# Altium schematic sheet Sheet2.SchDoc
size A4; SheetNumber: 2; SheetTotal: 2
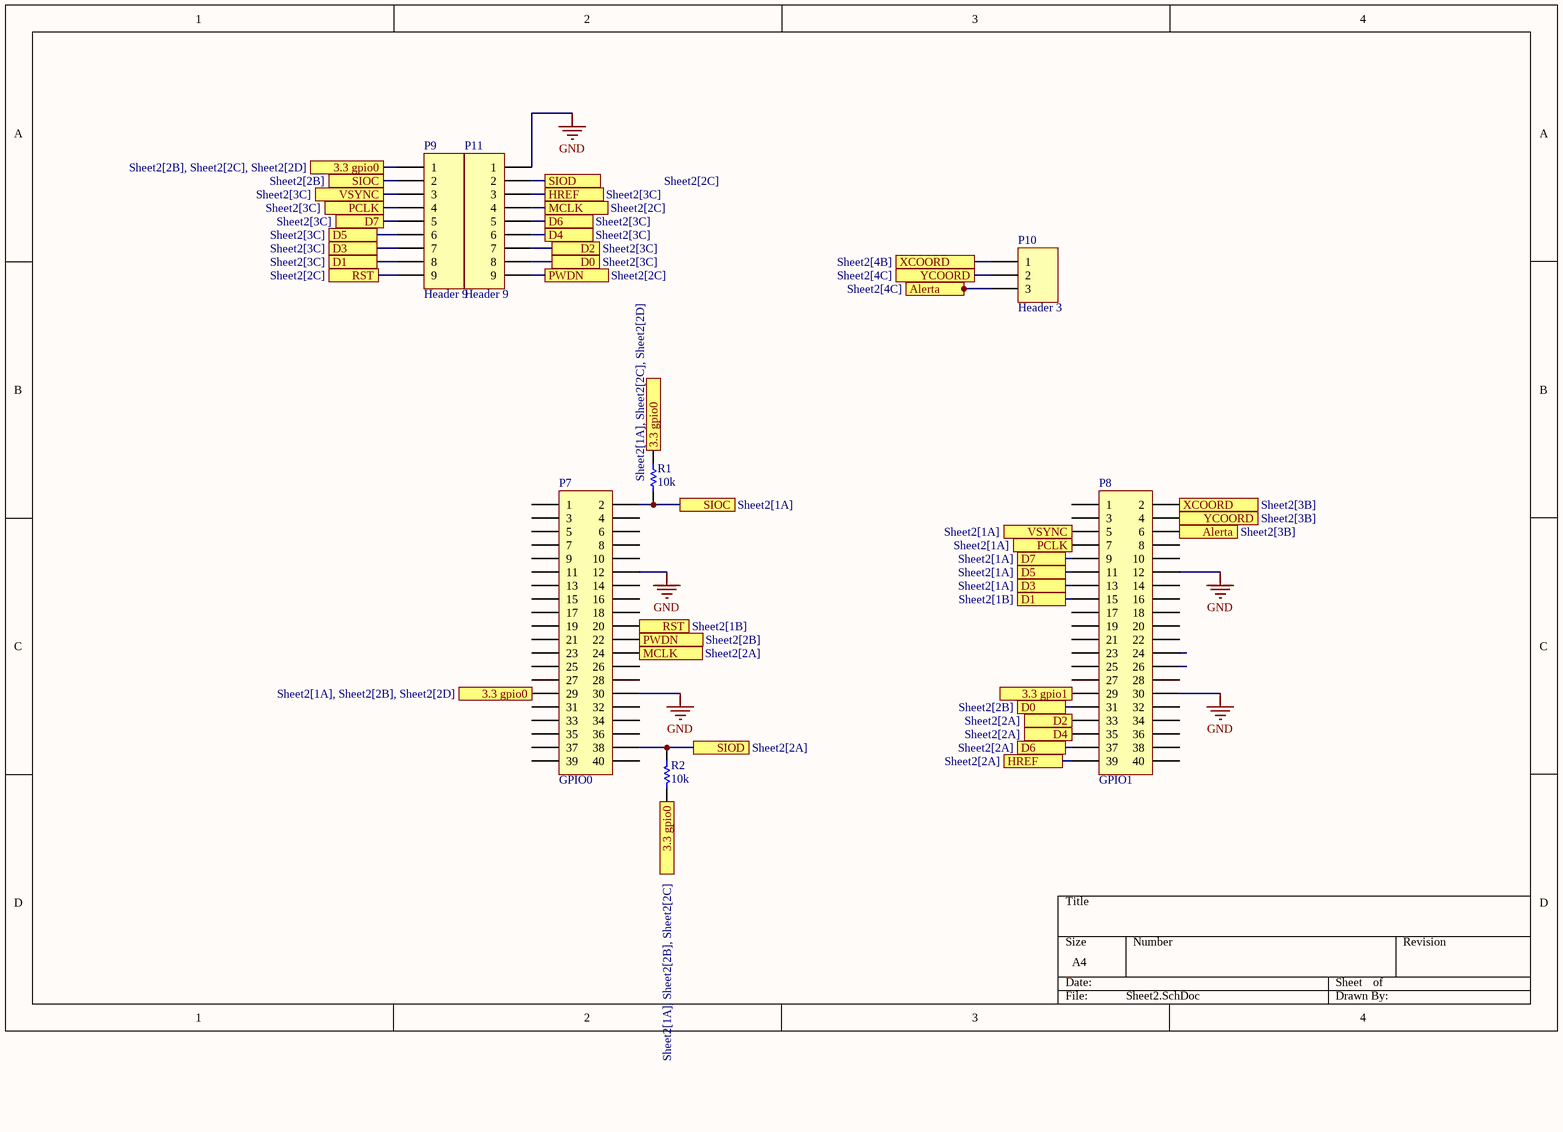
[diagram p0: Sheet2.SchDoc]

## Parts
P7  GPIO0  [HDR2X20]
P8  GPIO1  [HDR2X20]
P9  Header 9  [HDR1X9]
P10  Header 3  [HDR1X3]
P11  Header 9  [HDR1X9]
R1  value 10k  [RES 0.25 W - 0.4 In]  (hidden comment: Resistor)
R2  value 10k  [RES 0.25 W - 0.4 In]  (hidden comment: Resistor)

## Ports
3.3 gpio0 (see Sheet2[1A], Sheet2[2B], Sheet2[2C]), 3.3 gpio0 (see Sheet2[1A], Sheet2[2B], Sheet2[2D]), 3.3 gpio0 (see Sheet2[1A], Sheet2[2C], Sheet2[2D]), 3.3 gpio0 (see Sheet2[2B], Sheet2[2C], Sheet2[2D]), 3.3 gpio1, Alerta (see Sheet2[3B]), Alerta (see Sheet2[4C]), D0 (see Sheet2[2B]), D0 (see Sheet2[3C]), D1 (see Sheet2[1B]), D1 (see Sheet2[3C]), D2 (see Sheet2[2A]), D2 (see Sheet2[3C]), D3 (see Sheet2[1A]), D3 (see Sheet2[3C]), D4 (see Sheet2[2A]), D4 (see Sheet2[3C]), D5 (see Sheet2[1A]), D5 (see Sheet2[3C]), D6 (see Sheet2[2A]), D6 (see Sheet2[3C]), D7 (see Sheet2[1A]), D7 (see Sheet2[3C]), HREF (see Sheet2[2A]), HREF (see Sheet2[3C]), MCLK (see Sheet2[2A]), MCLK (see Sheet2[2C]), PCLK (see Sheet2[1A]), PCLK (see Sheet2[3C]), PWDN (see Sheet2[2B]), PWDN (see Sheet2[2C]), RST (see Sheet2[1B]), RST (see Sheet2[2C]), SIOC (see Sheet2[1A]), SIOC (see Sheet2[2B]), SIOD (see Sheet2[2A]), SIOD (see Sheet2[2C]), VSYNC (see Sheet2[1A]), VSYNC (see Sheet2[3C]), XCOORD (see Sheet2[3B]), XCOORD (see Sheet2[4B]), YCOORD (see Sheet2[3B]), YCOORD (see Sheet2[4C])

## Nets
GND: P7.12 P7.30 P8.12 P8.30 P11.1
3.3 gpio0: P7.29 P9.1 R1.2 R2.2 ; port 3.3 gpio0
3.3 gpio1: P8.29 ; port 3.3 gpio1
Alerta: P8.6 P10.3 ; port Alerta
D0: P8.31 P11.8 ; port D0
D1: P8.15 P9.8 ; port D1
D2: P8.33 P11.7 ; port D2
D3: P8.13 P9.7 ; port D3
D4: P8.35 P11.6 ; port D4
D5: P8.11 P9.6 ; port D5
D6: P8.37 P11.5 ; port D6
D7: P8.9 P9.5 ; port D7
HREF: P8.39 P11.3 ; port HREF
MCLK: P7.24 P11.4 ; port MCLK
PCLK: P8.7 P9.4 ; port PCLK
PWDN: P7.22 P11.9 ; port PWDN
RST: P7.20 P9.9 ; port RST
SIOC: P7.2 P9.2 R1.1 ; port SIOC
SIOD: P7.38 P11.2 R2.1 ; port SIOD
VSYNC: P8.5 P9.3 ; port VSYNC
XCOORD: P8.2 P10.1 ; port XCOORD
YCOORD: P8.4 P10.2 ; port YCOORD

Not connected (* = marked no-connect by the designer): P7 1 3 4 5 6 7 8 9 10 11 13 14 15 16 17 18 19 21 23 25 26 27 28 31 32 33 34 35 36 37 39 40; P8 1 3 8 10 14 16 17 18 19 20 21 22 23 24 25 26 27 28 32 34 36 38 40

## Library data of the parts
P7 P8 = Header 20X2: Header, 20-Pin, Dual row; LatestRevisionDate: 17-Jul-2002; LatestRevisionNote: Re-released for DXP Platform.; Publisher: Altium Limited
P9 P11 = Header 9: Header, 9-Pin; LatestRevisionDate: 17-Jul-2002; LatestRevisionNote: Re-released for DXP Platform.; Publisher: Altium Limited
P10 = Header 3: Header, 3-Pin; LatestRevisionDate: 17-Jul-2002; LatestRevisionNote: Re-released for DXP Platform.; Publisher: Altium Limited